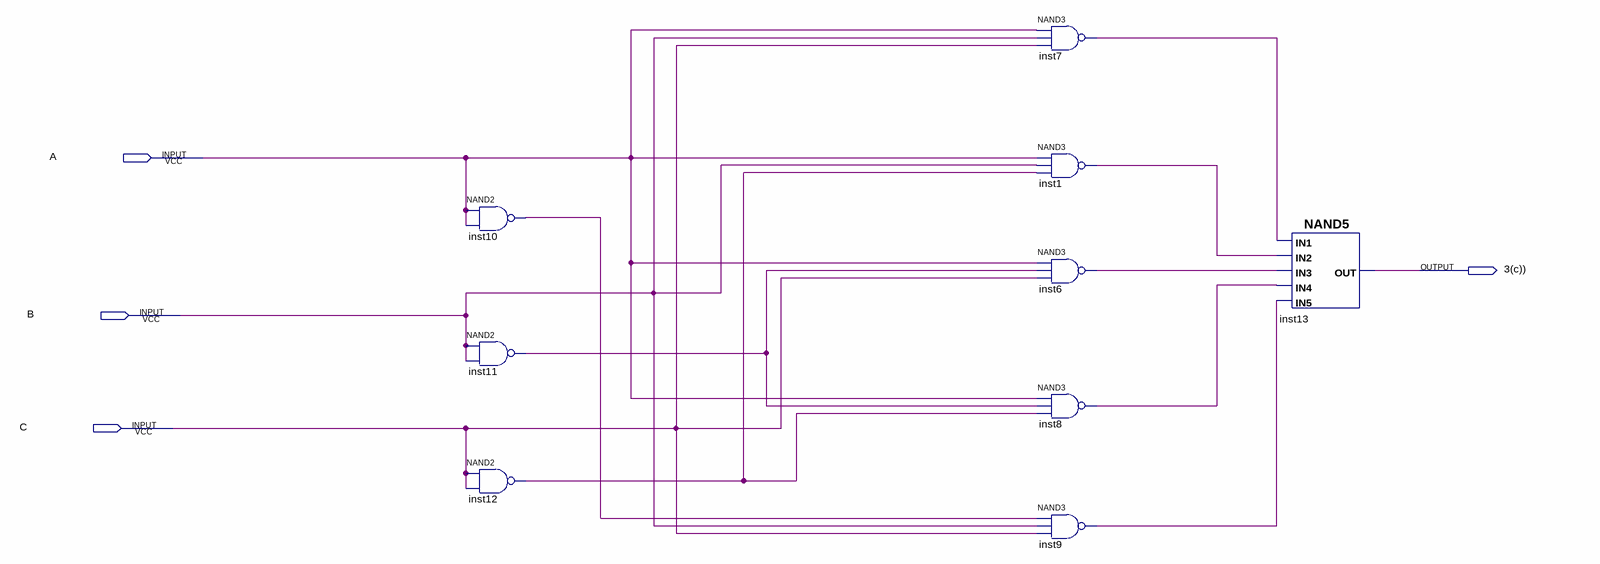
[diagram p0: schematic sheet]
// Quartus schematic Q3(c).bdf as structural Verilog: 9 symbols, 4 pins
module \Q3(c)  (
  input  A,
  input  B,
  input  C,
  output \3(c)) 
);

  wire inst1_out, inst6_out, inst7_out, inst8_out, inst9_out, inst10_out, inst11_out, inst12_out;

  nand inst10 (inst10_out, A, A);
  nand inst11 (inst11_out, B, B);
  nand inst12 (inst12_out, C, C);
  nand inst7 (inst7_out, A, B, C);
  nand inst1 (inst1_out, A, B, inst12_out);
  nand inst6 (inst6_out, A, inst11_out, C);
  nand inst8 (inst8_out, A, inst11_out, inst12_out);
  nand inst9 (inst9_out, inst10_out, B, C);
  nand inst13 (\3(c)) , inst7_out, inst1_out, inst6_out, inst8_out, inst9_out);
endmodule
